# EAGLE schematic 207 (EAGLE 9.6.2)
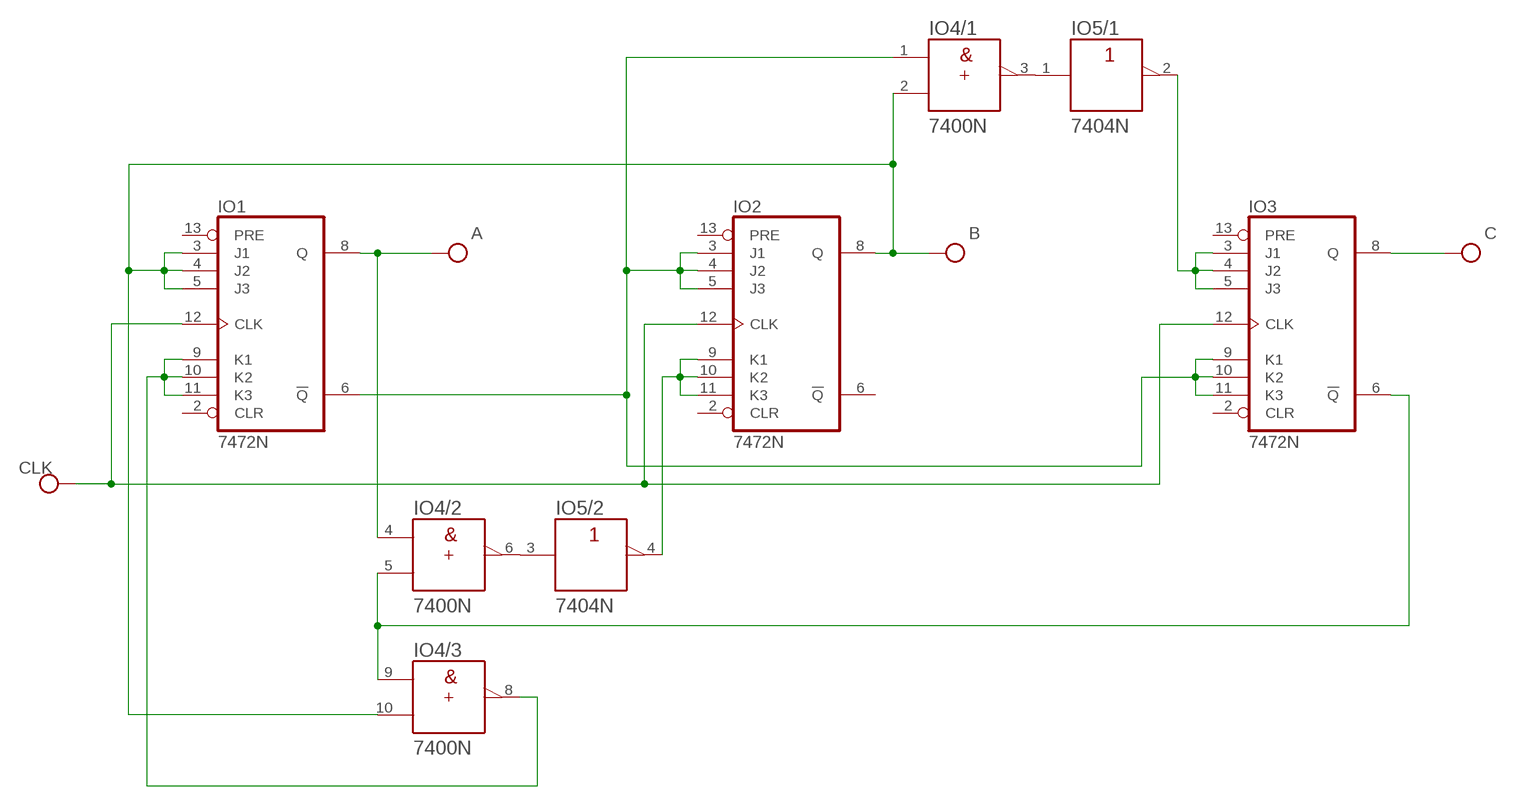
[diagram p0: schematic, sheet 1]

## Parts
IO1  7472N  [DIL14]
IO2  7472N  [DIL14]
IO3  7472N  [DIL14]
IO4  7400N  [DIL14]
IO5  7404N  [DIL14]

## Nets
N$1: IO4.6(/2:Y) IO5.3(/2:A)
N$2: IO1.9(K1) IO1.10(K2) IO1.11(K3) IO4.8(/3:Y)
N$3: IO1.6(!Q) IO2.3(J1) IO2.4(J2) IO2.5(J3) IO3.9(K1) IO3.10(K2) IO3.11(K3) IO4.1(/1:A)
N$4: IO2.9(K1) IO2.10(K2) IO2.11(K3) IO5.4(/2:Y)
N$5: IO3.3(J1) IO3.4(J2) IO3.5(J3) IO5.2(/1:Y)
N$7: IO4.3(/1:Y) IO5.1(/1:A)
N$8: IO3.6(!Q) IO4.5(/2:B) IO4.9(/3:A)
VCC: IO1.3(J1) IO1.4(J2) IO1.5(J3) IO1.8(Q) IO1.12(CLK) IO2.8(Q) IO2.12(CLK) IO3.8(Q) IO3.12(CLK) IO4.2(/1:B) IO4.4(/2:A) IO4.10(/3:B) ; supply symbol labelled CLK, A, B, C
Unconnected: IO1.2(CLR) IO1.13(PRE) IO2.2(CLR) IO2.6(!Q) IO2.13(PRE) IO3.2(CLR) IO3.13(PRE) IO4.11(/4:Y) IO4.12(/4:A) IO4.13(/4:B) IO5.5(/3:A) IO5.6(/3:Y) IO5.8(/4:Y) IO5.9(/4:A) IO5.10(/5:Y) IO5.11(/5:A) IO5.12(/6:Y) IO5.13(/6:A)

## Power pins joined to a net without a drawn wire
+UB: IO4.14(/+UB:+UB) IO5.14(/+UB:+UB)
-UB: IO4.7(/-UB:-UB) IO5.7(/-UB:-UB)
GND: IO1.7(GND) IO2.7(GND) IO3.7(GND)
VCC: IO1.14(VCC) IO2.14(VCC) IO3.14(VCC)

## Library data of the parts
IO1-IO3 = 74xx-eu:74*72: AND gated J-K master slave FLIP FLOP, preset and clear
IO4 = 74ttl-din:74*00: Quad 2-input NAND gate
IO5 = 74ttl-din:74*04: Hex INVERTER